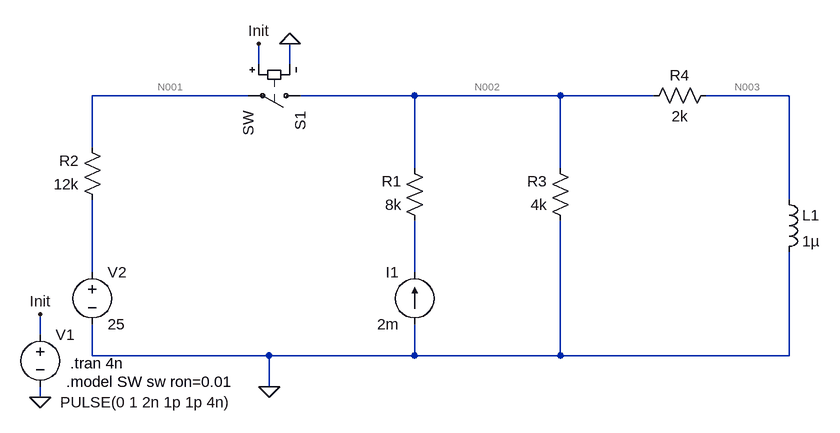
[diagram p0: schematic Circuit.asc]
Circuit.asc, the LTspice schematic file:
Version 4
SHEET 1 1236 744
WIRE 368 48 368 16
WIRE 416 48 416 16
WIRE 352 96 112 96
WIRE 608 96 432 96
WIRE 832 96 608 96
WIRE 976 96 832 96
WIRE 1184 96 1056 96
WIRE 112 176 112 96
WIRE 608 208 608 96
WIRE 832 208 832 96
WIRE 1184 256 1184 96
WIRE 112 368 112 256
WIRE 608 368 608 288
WIRE 32 464 32 432
WIRE 112 496 112 448
WIRE 384 496 112 496
WIRE 608 496 608 448
WIRE 608 496 384 496
WIRE 832 496 832 288
WIRE 832 496 608 496
WIRE 1184 496 1184 336
WIRE 1184 496 832 496
WIRE 384 544 384 496
WIRE 32 560 32 544
FLAG 32 560 0
FLAG 32 432 Init
FLAG 368 16 Init
FLAG 416 16 0
FLAG 384 544 0
SYMBOL sw 448 96 R90
SYMATTR InstName S1
SYMBOL voltage 32 448 R0
WINDOW 3 31 120 Left 2
WINDOW 123 0 0 Left 0
WINDOW 39 0 0 Left 0
SYMATTR InstName V1
SYMATTR Value PULSE(0 1 2n 1p 1p 4n)
SYMBOL current 608 448 R180
WINDOW 0 24 80 Left 2
WINDOW 3 24 0 Left 2
WINDOW 123 0 0 Left 0
WINDOW 39 0 0 Left 0
SYMATTR InstName I1
SYMATTR Value 2m
SYMBOL res 624 304 R180
WINDOW 0 36 76 Left 2
WINDOW 3 36 40 Left 2
SYMATTR InstName R1
SYMATTR Value 8k
SYMBOL voltage 112 352 R0
WINDOW 123 0 0 Left 0
WINDOW 39 0 0 Left 0
SYMATTR InstName V2
SYMATTR Value 25
SYMBOL res 128 272 R180
WINDOW 0 36 76 Left 2
WINDOW 3 36 40 Left 2
SYMATTR InstName R2
SYMATTR Value 12k
SYMBOL res 848 304 R180
WINDOW 0 36 76 Left 2
WINDOW 3 36 40 Left 2
SYMATTR InstName R3
SYMATTR Value 4k
SYMBOL res 1072 80 R90
WINDOW 0 0 56 VBottom 2
WINDOW 3 32 56 VTop 2
SYMATTR InstName R4
SYMATTR Value 2k
SYMBOL ind 1168 240 R0
SYMATTR InstName L1
SYMATTR Value 1µ
TEXT 78 508 Left 2 !.tran 4n
TEXT 72 536 Left 2 !.model SW sw ron=0.01

The netlist it stands for:
* Circuit.asc
S1 N002 N001 Init 0 SW
V1 Init 0 PULSE(0 1 2n 1p 1p 4n)
I1 0 N005 2m
R1 N005 N002 8k
V2 N004 0 25
R2 N004 N001 12k
R3 0 N002 4k
R4 N003 N002 2k
L1 N003 0 1µ
.tran 4n
.model SW sw ron=0.01
.backanno
.end

* Results of the author's LTspice run, read from the files saved beside the schematic
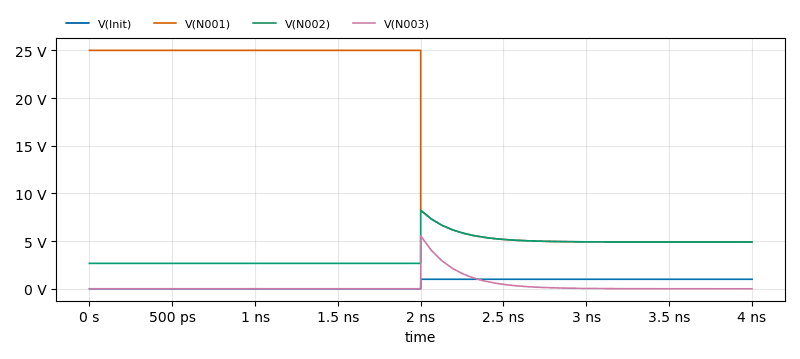
[diagram p1: Transient Analysis of Circuit.asc, plotted from the saved traces]
* Transient Analysis, 1 run:
*   V(Init): min 0 V, max 1 V, average 499.9 mV, rms 707 mV, last 1 V
*   V(N001): min 4.9 V, max 25 V, average 15.12 V, rms 18.07 V, last 4.9 V
*   V(N002): min 2.667 V, max 8.23 V, average 3.952 V, rms 4.184 V, last 4.9 V
*   V(N003): min 1.333 µV, max 5.55 V, average 281.4 mV, rms 894.8 mV, last 267.5 µV